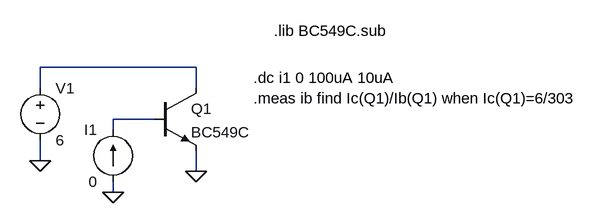
[diagram p0: schematic BC549Cm.asc]
BC549Cm.asc, the LTspice schematic file:
Version 4
SHEET 1 1472 680
WIRE 704 112 464 112
WIRE 464 144 464 112
WIRE 704 144 704 112
WIRE 640 192 576 192
WIRE 576 208 576 192
WIRE 464 256 464 224
WIRE 704 272 704 240
WIRE 576 304 576 288
FLAG 464 256 0
FLAG 576 304 0
FLAG 704 272 0
SYMBOL npn 640 144 R0
SYMATTR InstName Q1
SYMATTR Value BC549C
SYMBOL voltage 464 128 R0
SYMATTR InstName V1
SYMATTR Value 6
SYMBOL current 576 288 R180
WINDOW 0 24 80 Left 2
WINDOW 3 24 0 Left 2
SYMATTR InstName I1
SYMATTR Value 0
TEXT 824 56 Left 2 !.lib BC549C.sub
TEXT 792 128 Left 2 !.dc i1 0 100uA 10uA\n.meas ib find Ic(Q1)/Ib(Q1) when Ic(Q1)=6/303

The netlist it stands for:
* BC549Cm.asc
Q1 N001 N002 0 0 BC549C
V1 N001 0 6
I1 0 N002 0
.model NPN NPN
.model PNP PNP
.lib standard.bjt
.lib BC549C.sub
.dc i1 0 100uA 10uA
.meas ib find Ic(Q1)/Ib(Q1) when Ic(Q1)=6/303
.backanno
.end